# Altium project Vobla.PrjPcb
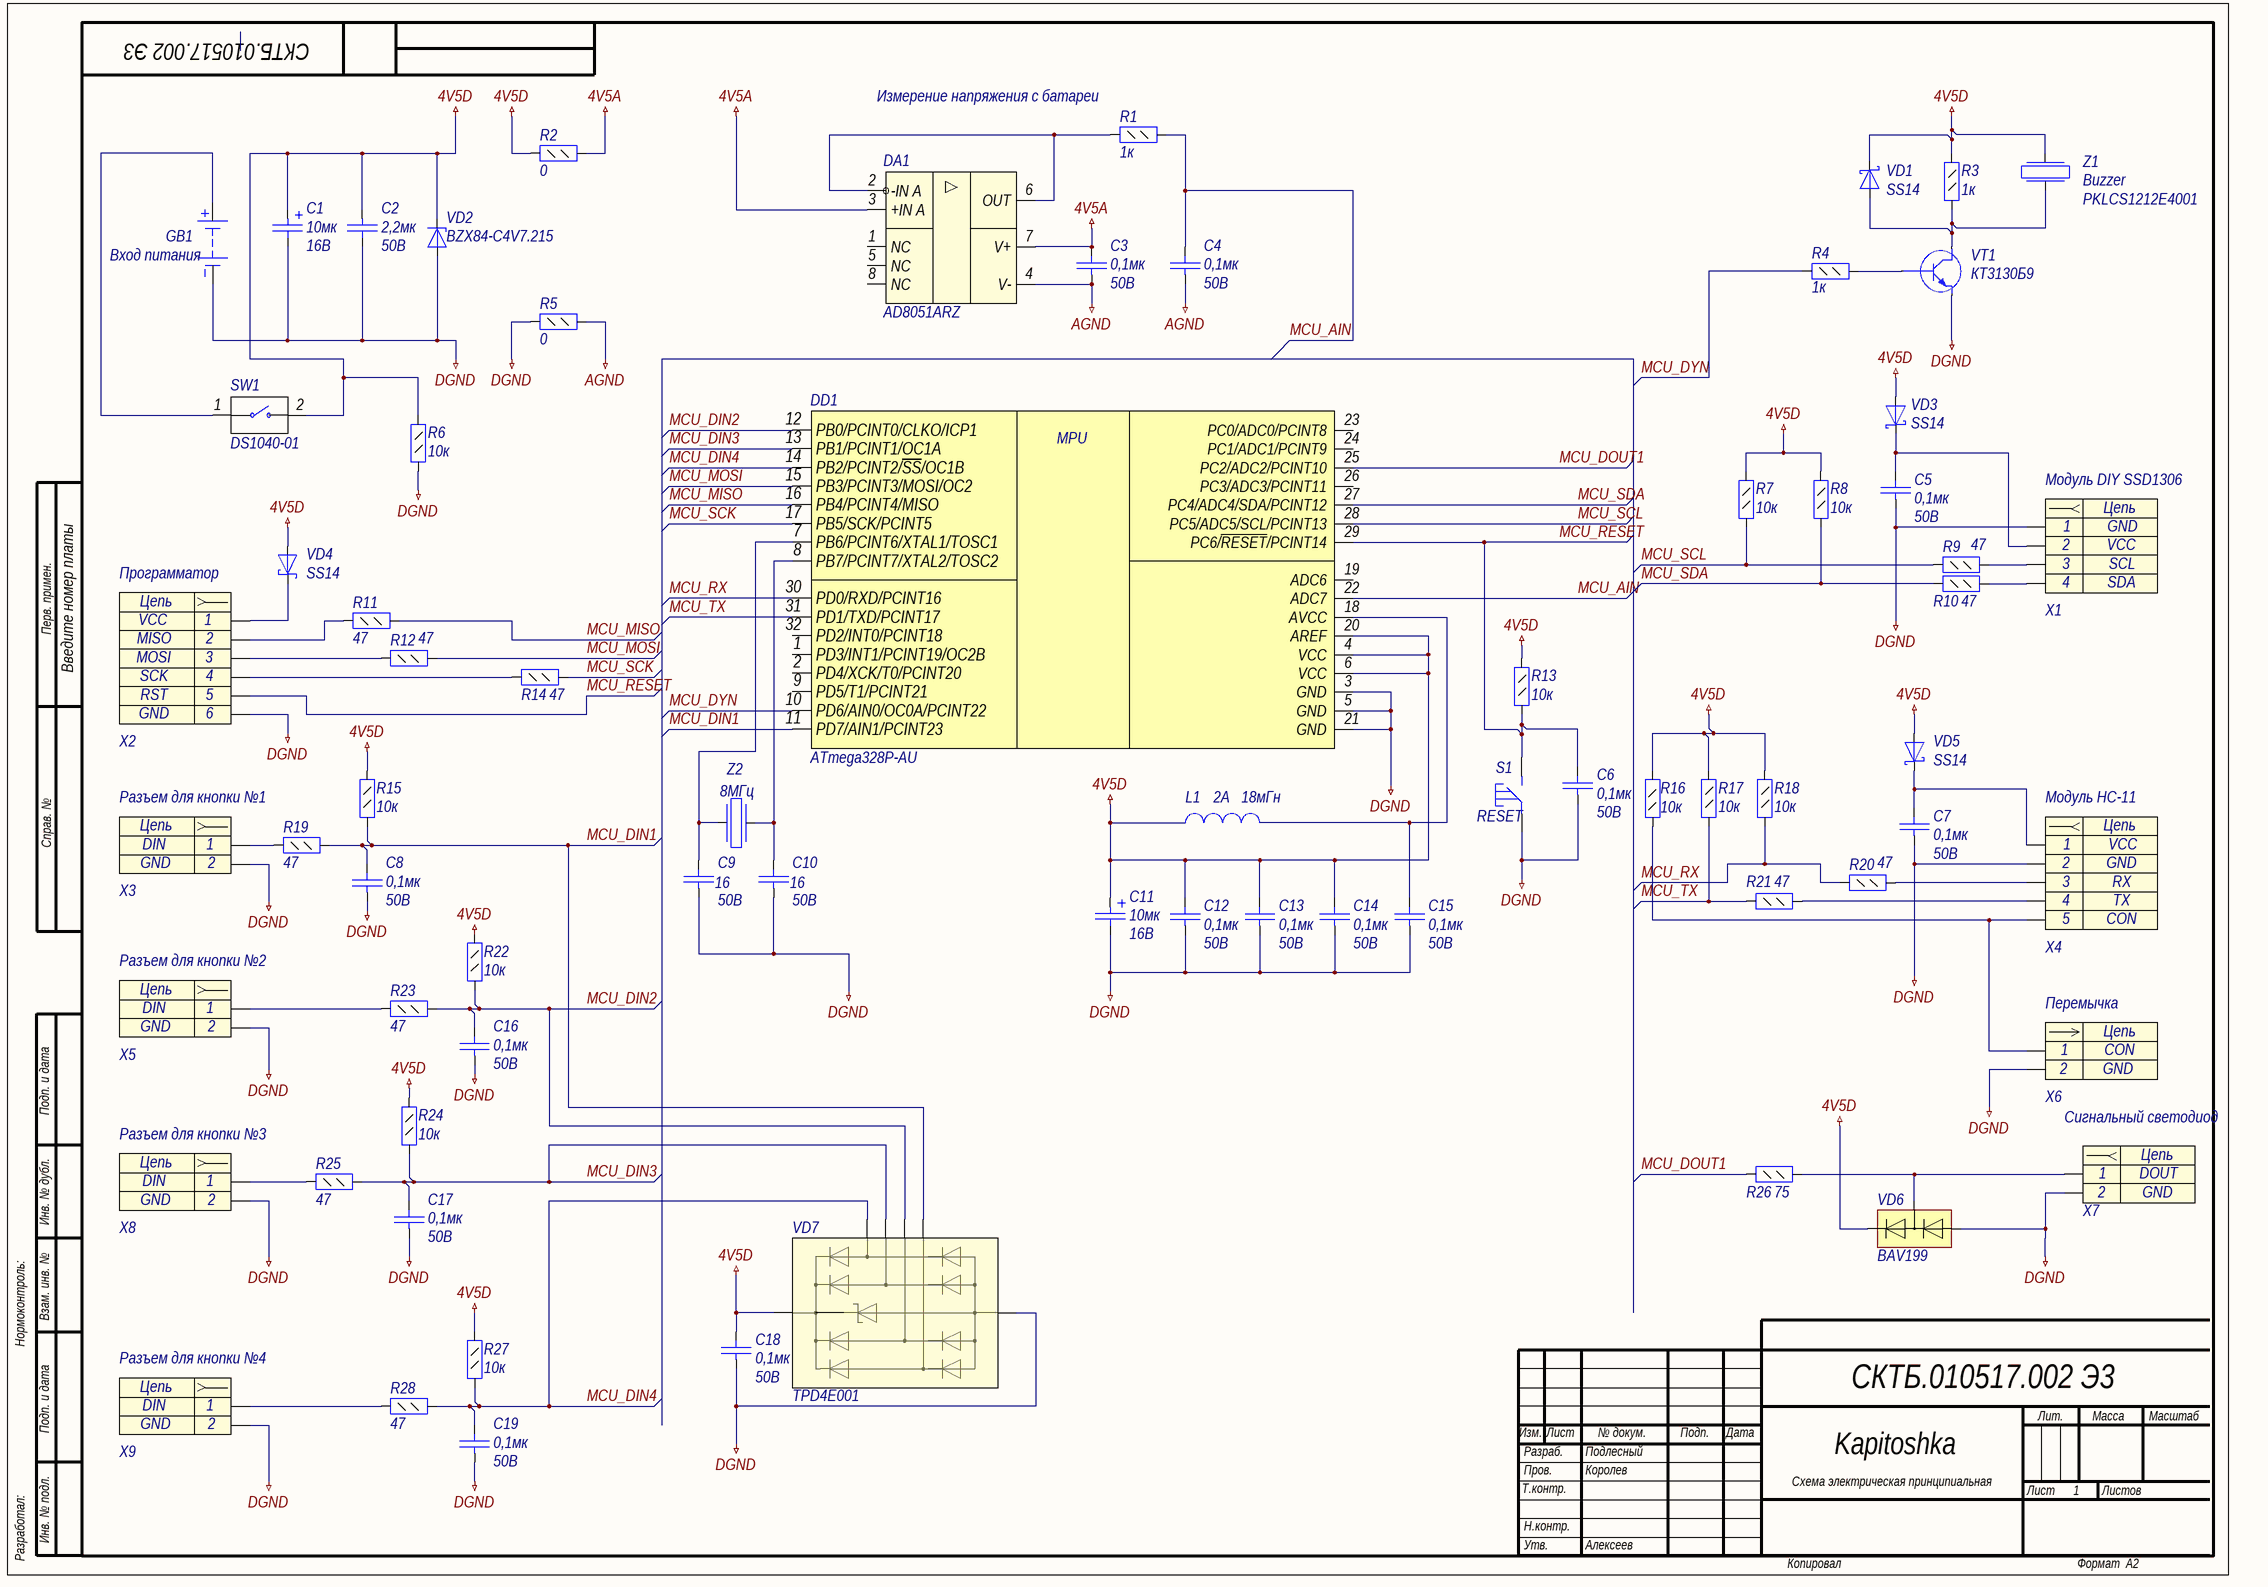
[diagram p0: Vobla.SchDoc]
1 sheet, 72 parts. Net scope: global (net labels, ports and power ports of the same name join across sheets).
Board file: Vobla.PcbDoc

## Sheet Vobla.SchDoc: Kapitoshka
size 594 x 420 mm; ApprovedBy: Алексеев; CheckedBy: Королев; DrawnBy: Подлесный; DocumentNumber: СКТБ.010517.002 Э3; SheetNumber: 1; Format: A2; DocumentType: Схема электрическая принципиальная; ImagePath: Введите номер платы

### Parts
C1  Voltage: 16В  [C1206]  (hidden comment: 10мк)
C2  Voltage: 50В  [C0603]  (hidden comment: 2,2мк)
C3  Voltage: 50В  [C0603]  (hidden comment: 0,1мк)
C4  Voltage: 50В  [C0603]  (hidden comment: 0,1мк)
C5  Voltage: 50В  [C0603]  (hidden comment: 0,1мк)
C6  Voltage: 50В  [C0603]  (hidden comment: 0,1мк)
C7  Voltage: 50В  [C0603]  (hidden comment: 0,1мк)
C8  Voltage: 50В  [C0603]  (hidden comment: 0,1мк)
C9  16  Voltage: 50В  [C0603]
C10  16  Voltage: 50В  [C0603]
C11  Voltage: 16В  [C1206]  (hidden comment: 10мк)
C12  Voltage: 50В  [C0603]  (hidden comment: 0,1мк)
C13  Voltage: 50В  [C0603]  (hidden comment: 0,1мк)
C14  Voltage: 50В  [C0603]  (hidden comment: 0,1мк)
C15  Voltage: 50В  [C0603]  (hidden comment: 0,1мк)
C16  Voltage: 50В  [C0603]  (hidden comment: 0,1мк)
C17  Voltage: 50В  [C0603]  (hidden comment: 0,1мк)
C18  Voltage: 50В  [C0603]  (hidden comment: 0,1мк)
C19  Voltage: 50В  [C0603]  (hidden comment: 0,1мк)
DA1  AD8051ARZ  [SO8_H]
DD1  ATmega328P-AU  [TQFP-32]
GB1  Вход питания  [KLS5-818-С]
L1  Imax: 2А  [L0603_H]  (hidden comment: 18мГн)
R1  1к  [R0603]
R2  0  [R0603]
R3  1к  [R0603]
R4  1к  [R0603]
R5  0  [R0603]
R6  10к  [R0603]
R7  10к  [R0603]
R8  10к  [R0603]
R9  47  [R0603]
R10  47  [R0603]
R11  47  [R0603]
R12  47  [R0603]
R13  10к  [R0603]
R14  47  [R0603]
R15  10к  [R0603]
R16  10к  [R0603]
R17  10к  [R0603]
R18  10к  [R0603]
R19  47  [R0603]
R20  47  [R0603]
R21  47  [R0603]
R22  10к  [R0603]
R23  47  [R0603]
R24  10к  [R0603]
R25  47  [R0603]
R26  75  [R0603]
R27  10к  [R0603]
R28  47  [R0603]
S1  RESET  [DTSM 32]
SW1  DS1040-01  [DIP1]
VD1  SS14  [SMA]
VD2  BZX84-C4V7.215  [SOT23-2_H]
VD3  SS14  [SMA]
VD4  SS14  [SMA]
VD5  SS14  [SMA]
VD6  BAV199  [SOT23-3]
VD7  TPD4E001  [SOT23-6]
VT1  КТ3130Б9  [SOT23-3]
X1  Модуль DIY SSD1306  [4HOLE_WIRE]
X2  Программатор  [6HOLE_WIRE]
X3  Разъем для кнопки №1  [2HOLE_Button]
X4  Модуль HC-11  [5HOLE_WIRE]
X5  Разъем для кнопки №2  [2HOLE_Button]
X6  Перемычка  [PLS2-2]
X7  Сигнальный светодиод  [2HOLE_Led]
X8  Разъем для кнопки №3  [2HOLE_Button]
X9  Разъем для кнопки №4  [2HOLE_Button]
Z1  PKLCS1212E4001  value Buzzer  [Piezoelectric Sounder]
Z2  8МГц  [QSMD3.2x5]

### Nets
4V5A: C3.2 DA1.3(+IN_A) DA1.7(V+) R2.2
4V5D: C1.1 C2.1 C11.1 C12.2 C13.2 C14.2 C18.2 DD1.4(VCC) DD1.6(VCC) DD1.20(AREF) L1.1 R2.1 R3.1 R6.1 R7.1 R8.1 R13.1 R15.1 R16.2 R17.1 R18.1 R22.1 R24.1 R27.1 SW1.2 VD1.1(K) VD2.1(K) VD3.2(A) VD4.2(A) VD5.2(A) VD6.1 VD7.5(VCC) Z1.2
AGND: C3.1 C4.1 DA1.4(V-) R5.2
DGND: C1.2 C2.2 C5.1 C6.1 C7.1 C8.1 C9.1 C10.1 C11.2 C12.1 C13.1 C14.1 C15.1 C16.1 C17.1 C18.1 C19.1 DD1.3(GND) DD1.5(GND) DD1.21(GND) GB1.2 R5.1 R6.2 S1.1 VD2.2(A) VD6.2 VD7.2(GND) VT1.2(Emitter) X1.1 X2.6 X3.2 X4.2 X5.2 X6.2 X7.2 X8.2 X9.2
MCU_AIN: C4.2 DD1.22(ADC7) R1.2
MCU_DIN1: C8.2 DD1.11(PD7/AIN1/PCINT23) R15.2 R19.2 VD7.6(IO4)
MCU_DIN2: C16.2 DD1.12(PB0/PCINT0/CLKO/ICP1) R22.2 R23.2 VD7.4(IO3)
MCU_DIN3: C17.2 DD1.13(PB1/PCINT1/OC1A) R24.2 R25.2 VD7.3(IO2)
MCU_DIN4: C19.2 DD1.14(PB2/PCINT2/~{SS}/OC1B) R27.2 R28.2 VD7.1(IO1)
MCU_DOUT1: DD1.25(PC2/ADC2/PCINT10) R26.1
MCU_DYN: DD1.10(PD6/AIN0/OC0A/PCINT22) R4.1
MCU_MISO: DD1.16(PB4/PCINT4/MISO) R11.2
MCU_MOSI: DD1.15(PB3/PCINT3/MOSI/OC2) R12.2
MCU_RESET: C6.2 DD1.29(PC6/~{RESET}/PCINT14) R13.2 S1.3 X2.5
MCU_RX: DD1.30(PD0/RXD/PCINT16) R18.2 R20.1
MCU_SCK: DD1.17(PB5/SCK/PCINT5) R14.2
MCU_SCL: DD1.28(PC5/ADC5/SCL/PCINT13) R7.2 R9.1
MCU_SDA: DD1.27(PC4/ADC4/SDA/PCINT12) R8.2 R10.1
MCU_TX: DD1.31(PD1/TXD/PCINT17) R17.2 R21.1
NetC5_2: C5.2 VD3.1(K) X1.2
NetC7_2: C7.2 VD5.1(K) X4.1
NetC9_2: C9.2 DD1.7(PB6/PCINT6/XTAL1/TOSC1) Z2.2
NetC10_2: C10.2 DD1.8(PB7/PCINT7/XTAL2/TOSC2) Z2.1
NetC15_2: C15.2 DD1.18(AVCC) L1.2
NetDA1_2: DA1.2(-IN_A) DA1.6(OUT) R1.1
NetGB1_1: GB1.1 SW1.1
NetR3_2: R3.2 VD1.2(A) VT1.3(Collector) Z1.1
NetR4_2: R4.2 VT1.1(Base)
NetR9_2: R9.2 X1.3
NetR10_2: R10.2 X1.4
NetR11_1: R11.1 X2.2
NetR12_1: R12.1 X2.3
NetR14_1: R14.1 X2.4
NetR16_1: R16.1 X4.5 X6.1
NetR19_1: R19.1 X3.1
NetR20_2: R20.2 X4.3
NetR21_2: R21.2 X4.4
NetR23_1: R23.1 X5.1
NetR25_1: R25.1 X8.1
NetR26_2: R26.2 VD6.3 X7.1
NetR28_1: R28.1 X9.1
NetVD4_1: VD4.1(K) X2.1

Not connected (* = marked no-connect by the designer): DA1 1(NC) 5(NC) 8(NC); DD1 1(PD3/INT1/PCINT19/OC2B) 2(PD4/XCK/T0/PCINT20) 9(PD5/T1/PCINT21) 19(ADC6) 23(PC0/ADC0/PCINT8) 24(PC1/ADC1/PCINT9) 26(PC3/ADC3/PCINT11) 32(PD2/INT0/PCINT18)

### Notes on the sheet
- (near R1) Измерение напряжения с батареи
- Перв. примен.
- Справ. №
- Подп. и дата
- Инв. № дубл.
- Нормоконтроль:
- Взам. инв. №
- Изм.
- Лист
- № докум.
- Подп.
- Дата
- Лит.
- Масса
- Масштаб
- Т.контр.
- Пров.
- Разраб.
- Листов
- Разработал:
- Инв. № подл.
- Н.контр.
- Утв.
- Копировал
- Формат
- (in symbol ATmega328P-AU) MPU
- (in symbol Header_2_plg) Цепь
- (in symbol Header_2_sct) Цепь
- (in symbol Header_4_sct) Цепь
- (in symbol Header_5_sct) Цепь
- (in symbol Header_6_sct) Цепь

### Library data of the parts
C1 C11 = Capacitor_pol: Конденсатор полярный; Value: 10мк
C2-C10 C12-C19 = Capacitor: Конденсатор
  C2: Value: 2,2мк
  C3-C8 C12-C19: Value: 0,1мк
  C9 C10: Value: 16
DA1 = AD8051ARZ: ОУ; Operating Range: 3-12В; Quiescent Current: 4,4мА; Name: AD8051ARZ
DD1 = ATmega328P-AU: Микроконтроллер 64-pin; Name: ATmega328P-AU
GB1 = Battery compartment: Value: Вход питания
L1 = Inductor: Катушка индуктивности; Name: BLM18EG221SN10; Value: 18мГн
R1-R28 = Resistor_0,125Вт: Резистор
  R1 R3 R4: Value: 1к
  R2 R5: Value: 0
  R6-R8 R13 R15-R18 R22 R24 R27: Value: 10к
  R9-R12 R14 R19-R21 R23 R25 R28: Value: 47
  R26: Value: 75
S1 = Button_SMD: Кнопка; Name: RESET
SW1 = DS1040-01: DIP переключатель
VD1 VD3-VD5 = DiodeSchottky: Диод Шоттки; Name: SS14
VD2 = DiodeZener: Стабилитрон; Name: BZX84-C4V7.215
VD6 = BAV199: Диодная сборка
VD7 = TPD4E001: Диодная сборка; Manufacturer: Texas Instruments; Name: TPD4E001
VT1 = КТ3130Б9: Uкбо: 50В; Iк макс: 0.1; h21э: 200; fгр: 150МГц; Power: 0.1Вт; Name: КТ3130Б9
X1 = Header_4_sct: Разъем - 4 конт. розетка; Contact_1: GND; Contact_2: VCC; Contact_3: SCL; Contact_4: SDA; Name: Модуль DIY SSD1306
X2 = Header_6_sct: Разъем - 5 конт. розетка; Contact_1: VCC; Contact_2: MISO; Contact_3: MOSI; Contact_4: SCK; Contact_5: RST; Contact_6: GND; Name: Программатор
X3 X5 X8 X9 = Header_2_sct: Разъем - 2 конт. розетка; Contact_1: DIN; Contact_2: GND
  X3: Name: Разъем для кнопки №1
  X5: Name: Разъем для кнопки №2
  X8: Name: Разъем для кнопки №3
  X9: Name: Разъем для кнопки №4
X4 = Header_5_sct: Разъем - 4 конт. розетка; Contact_1: VCC; Contact_2: GND; Contact_3: RX; Contact_4: TX; Contact_5: CON; Name: Модуль HC-11
X6 = Header_2_plg: Разъем - 2 конт. вилка; Contact_1: CON; Contact_2: GND; Name: Перемычка
X7 = Header_2_sct: Разъем - 2 конт. розетка; Contact_1: DOUT; Contact_2: GND; Name: Сигнальный светодиод
Z1 = Buzzer: Пьезоизлучатель звуковой; Name: PKLCS1212E4001
Z2 = Crystal: Кварцевый резонатор; Value: 8МГц